# Altium schematic sheet Ethernet.SchDoc: Ethernet
size A4; Date: Not used; ApprovedBy: Not used; CheckedBy: Not used; Author: Not used; CompanyName: STMicroelectronics; DrawnBy: Not used; Engineer: Not used; Organization: Not used; Address1: Not used; Address2: Not used; Address3: Not used; Address4: Not used; DocumentNumber: 7; Revision: Not used; SheetNumber: 7; SheetTotal: 9; Time: Not used; ImagePath: Not used; Application_BuildNumber: Not used
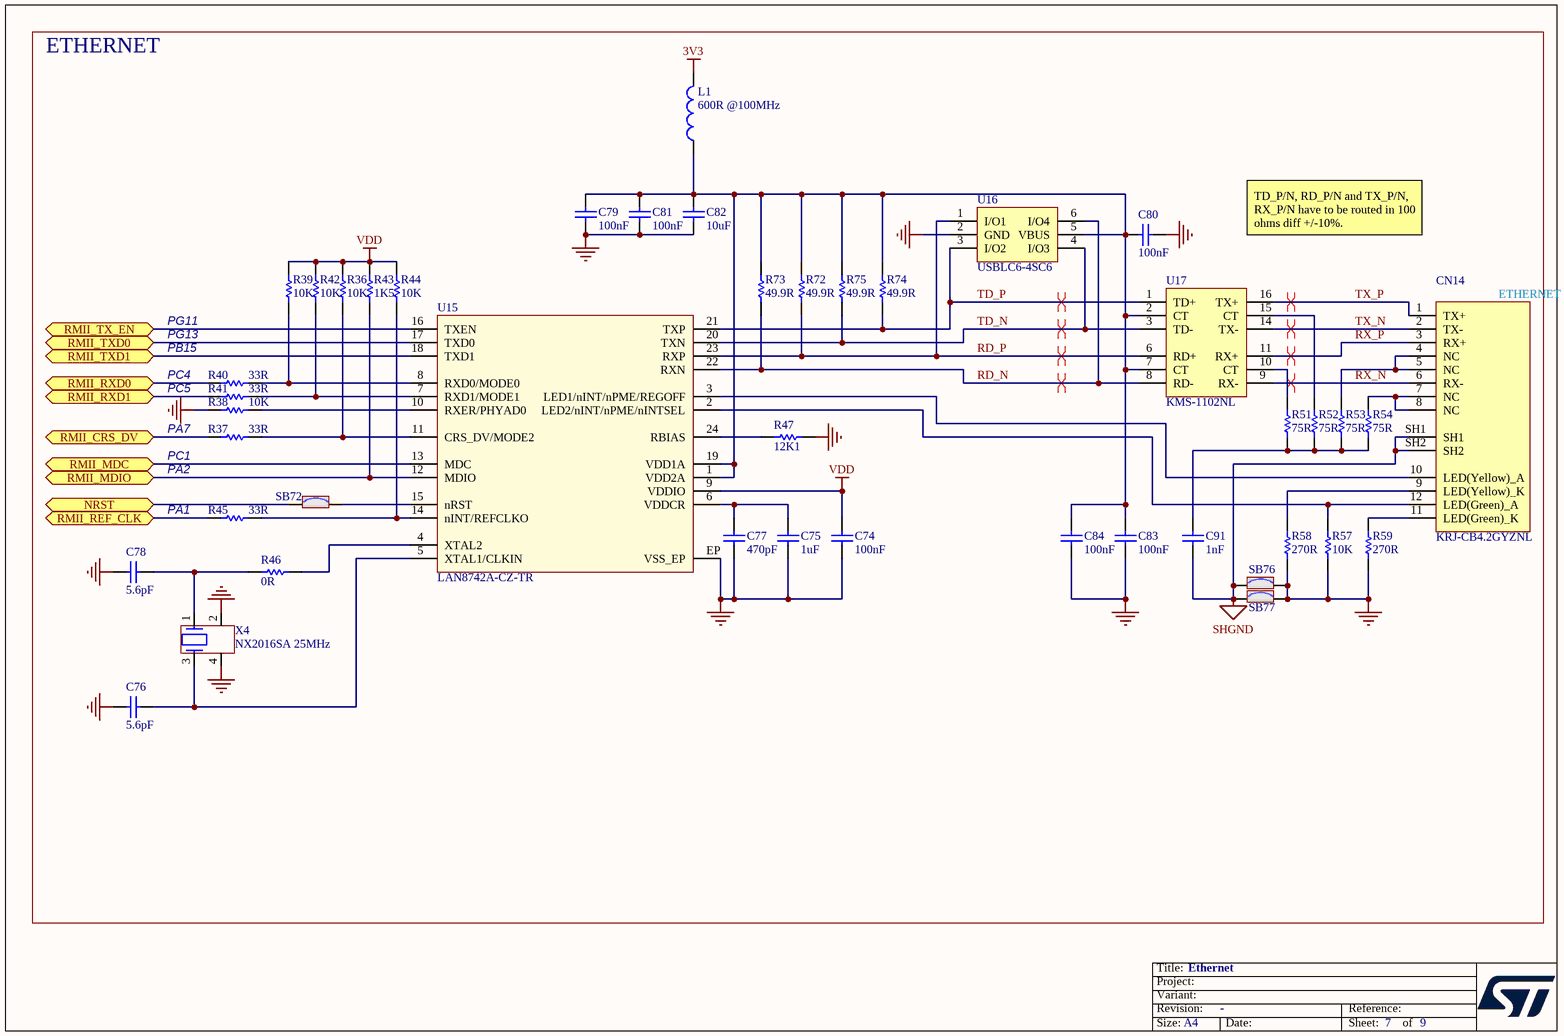
[diagram p0: Ethernet.SchDoc]

## Parts
C74  value 100nF  [C0603]  (hidden comment: Capacitor)
C75  value 1uF  [C0402]  (hidden comment: Capacitor)
C76  value 5.6pF  [C0402]  (hidden comment: Capacitor)
C77  value 470pF  [C0402]  (hidden comment: Capacitor)
C78  value 5.6pF  [C0402]  (hidden comment: Capacitor)
C79  value 100nF  [C0603]  (hidden comment: Capacitor)
C80  value 100nF  [C0603]  (hidden comment: Capacitor)
C81  value 100nF  [C0603]  (hidden comment: Capacitor)
C82  value 10uF  [C0603]  (hidden comment: Capacitor)
C83  value 100nF  [C0603]  (hidden comment: Capacitor)
C84  value 100nF  [C0603]  (hidden comment: Capacitor)
C91  value 1nF  [C1206_H1P6]  (hidden comment: Capacitor)
CN14  value KRJ-CB4.2GYZNL  [CON_RJ45_DGKYD_KRJ-CB4.2GYZNL]  (hidden comment: RJ45_KRJ-CB4.2GYZNL)
L1  value 600R @100MHz  [L0603]  (hidden comment: BEAD)
R36  value 10K  [R0402]  (hidden comment: Resistor)
R37  value 33R  [R0402]  (hidden comment: Resistor)
R38  value 10K  [R0402]  (hidden comment: Resistor)
R39  value 10K  [R0402]  (hidden comment: Resistor)
R40  value 33R  [R0402]  (hidden comment: Resistor)
R41  value 33R  [R0402]  (hidden comment: Resistor)
R42  value 10K  [R0402]  (hidden comment: Resistor)
R43  value 1K5  [R0402]  (hidden comment: Resistor)
R44  value 10K  [R0402]  (hidden comment: Resistor)
R45  value 33R  [R0402]  (hidden comment: Resistor)
R46  value 0R  [R0402]  (hidden comment: Resistor)
R47  value 12K1  [R0402]  (hidden comment: Resistor)
R51  value 75R  [R0402]  (hidden comment: Resistor)
R52  value 75R  [R0402]  (hidden comment: Resistor)
R53  value 75R  [R0402]  (hidden comment: Resistor)
R54  value 75R  [R0402]  (hidden comment: Resistor)
R57  value 10K  [R0402]  (hidden comment: Resistor)
R58  value 270R  [R0402]  (hidden comment: Resistor)
R59  value 270R  [R0402]  (hidden comment: Resistor)
R72  value 49.9R  [R0402]  (hidden comment: Resistor)
R73  value 49.9R  [R0402]  (hidden comment: Resistor)
R74  value 49.9R  [R0402]  (hidden comment: Resistor)
R75  value 49.9R  [R0402]  (hidden comment: Resistor)
SB72  SB_ON  [SOLDER-BRIDGE_R0603-0R]  (value not drawn)
SB76  SB_ON  [SOLDER-BRIDGE_R0603-0R]  (value not drawn)
SB77  SB_ON  [SOLDER-BRIDGE_R0603-0R]  (value not drawn)
U15  LAN8742A-CZ-TR  [ICC_VQFN24-EPAD_4X4_P050]
U16  USBLC6-4SC6  [ESD_SOT23-6L]
U17  KMS-1102NL  [TRS_DGKYD_KMS-1102NL]
X4  value NX2016SA 25MHz  [CRY_NX2016SA_4P]  (hidden comment: XTAL_4_PINS)

## Ports
NRST (bidir), RMII_CRS_DV (bidir), RMII_MDC (bidir), RMII_MDIO (bidir), RMII_REF_CLK (bidir), RMII_RXD0 (bidir), RMII_RXD1 (bidir), RMII_TX_EN (bidir), RMII_TXD0 (bidir), RMII_TXD1 (bidir)

## Nets
3V3: L1.2
GND: C74.1 C75.1 C76.1 C77.1 C78.1 C79.1 C80.1 C81.1 C82.1 C83.1 C84.1 R38.2 R47.2 R57.1 R58.1 R59.1 SB76.2 SB77.2 U15.EP(VSS_EP) U16.2(GND) X4.2 X4.4
SHGND: C91.1 CN14.SH1 CN14.SH2 SB76.1 SB77.1
VDD: C74.2 R36.2 R39.2 R42.2 R43.2 R44.2 U15.9(VDDIO)
NRST: SB72.1 ; port NRST
RD_N: R73.1 U15.22(RXN) U16.6(I/O4) U17.8(RD-)
RD_P: R72.1 U15.23(RXP) U16.1(I/O1) U17.6(RD+)
RMII_CRS_DV: R37.1 ; port RMII_CRS_DV
RMII_MDC: U15.13(MDC) ; port RMII_MDC
RMII_MDIO: R43.1 U15.12(MDIO) ; port RMII_MDIO
RMII_REF_CLK: R45.1 ; port RMII_REF_CLK
RMII_RXD0: R40.1 ; port RMII_RXD0
RMII_RXD1: R41.1 ; port RMII_RXD1
RMII_TX_EN: U15.16(TXEN) ; port RMII_TX_EN
RMII_TXD0: U15.17(TXD0) ; port RMII_TXD0
RMII_TXD1: U15.18(TXD1) ; port RMII_TXD1
RX_N: CN14.6(RX-) U17.9(RX-)
RX_P: CN14.3(RX+) U17.11(RX+)
TD_N: R75.1 U15.20(TXN) U16.4(I/O3) U17.3(TD-)
TD_P: R74.1 U15.21(TXP) U16.3(I/O2) U17.1(TD+)
TX_N: CN14.2(TX-) U17.14(TX-)
TX_P: CN14.1(TX+) U17.16(TX+)
NetC75_2: C75.2 C77.2 U15.6(VDDCR)
NetC76_2: C76.2 U15.5(XTAL1/CLKIN) X4.3
NetC78_2: C78.2 R46.1 X4.1
NetC79_2: C79.2 C80.2 C81.2 C82.2 C83.2 C84.2 L1.1 R72.2 R73.2 R74.2 R75.2 U15.1(VDD2A) U15.19(VDD1A) U16.5(VBUS) U17.2(CT) U17.7(CT)
NetC91_2: C91.2 R51.1 R52.1 R53.1 R54.1
NetCN14_4: CN14.4(NC) CN14.5(NC) R53.2
NetCN14_7: CN14.7(NC) CN14.8(NC) R54.2
NetCN14_9: CN14.9(LED(Yellow)_K) R58.2
NetCN14_10: CN14.10(LED(Yellow)_A) U15.3(LED1/nINT/nPME/REGOFF)
NetCN14_11: CN14.11(LED(Green)_K) R59.2
NetCN14_12: CN14.12(LED(Green)_A) R57.2 U15.2(LED2/nINT/nPME/nINTSEL)
NetR36_1: R36.1 R37.2 U15.11(CRS_DV/MODE2)
NetR38_1: R38.1 U15.10(RXER/PHYAD0)
NetR39_1: R39.1 R40.2 U15.8(RXD0/MODE0)
NetR41_2: R41.2 R42.1 U15.7(RXD1/MODE1)
NetR44_1: R44.1 R45.2 U15.14(nINT/REFCLKO)
NetR46_2: R46.2 U15.4(XTAL2)
NetR47_1: R47.1 U15.24(RBIAS)
NetR51_2: R51.2 U17.10(CT)
NetR52_2: R52.2 U17.15(CT)
NetSB72_2: SB72.2 U15.15(nRST)

## Layout directives
differential pair: RD_N, RD_P, RX_N, RX_P, TD_N, TD_P, TX_N, TX_P

## Notes on the sheet
- ETHERNET
- TD_P/N, RD_P/N and TX_P/N, RX_P/N have to be routed in 100 ohms diff +/-10%.
- (near CN14) ETHERNET
- PG11
- PG13
- PB15
- PC4
- PC5
- PA7
- PC1
- PA2
- (near R45) PA1
- Title:
- Project:
- Size:
- Revision:
- Variant:
- A4
- -
- Date:
- Reference:
- Sheet:
- of

## Library data of the parts
C74 C79-C81 C83 C84 = MCD-02119: Capacitor, MLCC, 100nF, 6V3, X5R, +/-10%, 0603, T=0.8mm; Part_Preference: Recommended; Manufacturer: KEMET; Manufacturer_Part_Number: C0603C104K9PACTU; Component_Country_Of_Origin: Mexico; ShowFields: YES; ID: 4219; Internal_Part_Number: MCD-02119; Status: Checked; Part_Type: Capacitor; Package: 0603; ComponentLink1URL: http://tunmcdsvn.tun.st.com/Component_Documentation_Library/Trunk/Capacitor/KEMET_X5R_Series/C0603C104K9PACTU; Order_Code_Digikey: N/A; Order_Code_Farnell: 2941311; Order_Code_RS: N/A
C75 = MCD-00095: Capacitor, MLCC, 1uF, 6V3, X5R, 10%, 0402, T=0,5mm; Manufacturer_Part_Number: GRM155R61E105KA12; Manufacturer: MURATA; Alternate_Manufacturer_Part_Number: GRM155R60J105KE19; Provided_By: SUBCO; ECCN_US: EAR99; ECCN_EU: NEC; Internal_Part_Number: MCD-00095; Status: Released; Part_Type: Capacitor; Package: C0402; ComponentLink1Description: Datasheet; ComponentLink1URL: http://tunmcdsvn.tun.st.com/Component_Datasheet_Library/Trunk/Capacitors/Murata_Capacitor_GR_series; Alternate_Manufacturer: MURATA
C76 C78 = MCD-01374: Capacitor, MLCC, 5.6pF, 50V, NPO, 5%, 0402, T=0,5mm; Manufacturer_Part_Number: CC0402BRNPO9BN5R6; Manufacturer: YAGEO; Provided_By: SUBCO; Internal_Part_Number: MCD-01374; Status: Released; Part_Type: Capacitor; Package: C0402; ComponentLink1Description: Datasheet; ComponentLink1URL: http://tunmcdsvn.tun.st.com/Component_Datasheet_Library/Trunk/Capacitors/Yageo_Capacitor_NP0_16V-to-50V; ECCN_US: N/A; ECCN_EU: N/A
C77 = MCD-00724: Capacitor, MLCC, 470pF, 50V, NPO, 5%, 0402, T=0,5mm; Manufacturer_Part_Number: CC0402JRNPO9BN471; Manufacturer: YAGEO; Provided_By: SUBCO; Internal_Part_Number: MCD-00724; Status: Released; Part_Type: Capacitor; Package: C0402; ComponentLink1Description: Datasheet; ComponentLink1URL: http://tunmcdsvn.tun.st.com/Component_Datasheet_Library/Trunk/Capacitors/Yageo_Capacitor_NP0_16V-to-50V; ECCN_US: N/A; ECCN_EU: N/A
C82 = MCD-01124: Capacitor, MLCC, 10µF, 10V, X5R, 10%, 0603, T=0.8mm; Manufacturer_Part_Number: GRM188R61A106KAAL; Manufacturer: MURATA; Provided_By: SUBCO; ECCN_US: EAR99; ECCN_EU: NEC; Internal_Part_Number: MCD-01124; Status: Released; Part_Type: Capacitor; Package: C0603; ComponentLink1Description: Datasheet; ComponentLink1URL: http://tunmcdsvn.tun.st.com/Component_Datasheet_Library/Trunk/Capacitors/Murata_Capacitor_GR_series
C91 = MCD-00722: Capacitor, MLCC, 1nF, 2KV, X7R, 10%, 1206, T=1,25mm; Manufacturer_Part_Number: CC1206KKX7RDBB102; Manufacturer: YAGEO; Provided_By: SUBCO; Internal_Part_Number: MCD-00722; Status: Released; Part_Type: Capacitor; Package: C1206; ComponentLink1Description: Datasheet; ComponentLink1URL: http://tunmcdsvn.tun.st.com/Component_Datasheet_Library/Trunk/Capacitors/Yageo_Multilayer_Capacitor_NPO_X7R_1KV_to_3KV_10pF_to_33nF/; ECCN_US: N/A; ECCN_EU: N/A
CN14 = MCD-00717: RJ45 jack, single port, with LEDS, Metal shielded dip low profile; Part_Type: Connector; Manufacturer: DONGGUAN KEYOUDA ELECTRONIC TECHNOLOGY; Provided_By: SUBCO; Internal_Part_Number: MCD-00717; Status: Released; Manufacturer_Part_Number: KRJ-CB4.2GYZNL; ComponentLink1Description: Datasheet; ComponentLink1URL: http://tunmcdsvn.tun.st.com/Component_Datasheet_Library/Trunk/Connectors/DGKYD_RJ45_KRJ-CB4.2GYZNL; ECCN_US: n/a; ECCN_EU: n/a
L1 = MCD-02437: Ferrite bead, 600R@100MHz, +/-25%, 500mA, 380mR, 0603, T=0.8mm; Part_Type: Inductor; Part_Preference: Recommended; Manufacturer: MURATA; Manufacturer_Part_Number: BLM18AG601SN1D; Order_Code_RS: 724-1299; Internal_Part_Number: MCD-02437; Status: Checked; Alternate_Manufacturer: N/A; Alternate_Manufacturer_Part_Number: N/A; Package: 0603; ComponentLink1URL: http://tunmcdsvn.tun.st.com/Component_Documentation_Library/Trunk/Inductor/MURATA_BLM_Series/MURATA_BLM18_Series/; Order_Code_Digikey: 490-1014-1-ND; Order_Code_Farnell: 1515679
R36 R38 R39 R42 R44 R57 = MCD-00053: Resistor,10K,0402,1%,1/16W; Manufacturer_Part_Number: RC0402FR-0710KL; Manufacturer: YAGEO; Provided_By: SUBCO; ECCN_US: EAR99; ECCN_EU: NEC; Internal_Part_Number: MCD-00053; Status: Released; Part_Type: Resistor; Package: R0402; ComponentLink1Description: Datasheet; ComponentLink1URL: http://tunmcdsvn.tun.st.com/Component_Datasheet_Library/Trunk/Resistors/Yageo_Resistor_RC0402-series
R37 R40 R41 R45 = MCD-00455: Resistor,33R,0402,1%,1/16W; Manufacturer_Part_Number: RC0402FR-0733RL; Manufacturer: YAGEO; Provided_By: SUBCO; ECCN_US: EAR99; ECCN_EU: NEC; Internal_Part_Number: MCD-00455; Status: Released; Part_Type: Resistor; Package: R0402; ComponentLink1Description: Datasheet; ComponentLink1URL: http://tunmcdsvn.tun.st.com/Component_Datasheet_Library/Trunk/Resistors/Yageo_Resistor_RC0402-series
R43 = MCD-00068: Resistor,1K5,0402,1%,1/16W; Manufacturer_Part_Number: RC0402FR-071K5L; Manufacturer: YAGEO; Provided_By: SUBCO; ECCN_US: EAR99; ECCN_EU: NEC; Internal_Part_Number: MCD-00068; Status: Released; Part_Type: Resistor; Package: R0402; ComponentLink1Description: Datasheet; ComponentLink1URL: http://tunmcdsvn.tun.st.com/Component_Datasheet_Library/Trunk/Resistors/Yageo_Resistor_RC0402-series
R46 = MCD-00052: Resistor,0R,0402,5%,1/16W; Manufacturer_Part_Number: RC0402JR-070RL; Manufacturer: YAGEO; Provided_By: SUBCO; ECCN_US: EAR99; ECCN_EU: NEC; Internal_Part_Number: MCD-00052; Status: Released; Part_Type: Resistor; Package: R0402; ComponentLink1Description: Datasheet; ComponentLink1URL: http://tunmcdsvn.tun.st.com/Component_Datasheet_Library/Trunk/Resistors/Yageo_Resistor_RC0402-series
R47 = MCD-00723: Resistor,12K1,0402,1%,1/16W; Manufacturer_Part_Number: RC0402FR-0712K1L; Manufacturer: YAGEO; Provided_By: SUBCO; ECCN_US: EAR99; ECCN_EU: NEC; Internal_Part_Number: MCD-00723; Status: Released; Part_Type: Resistor; Package: R0402; ComponentLink1Description: Datasheet; ComponentLink1URL: http://tunmcdsvn.tun.st.com/Component_Datasheet_Library/Trunk/Resistors/Yageo_Resistor_RC0402-series
R51-R54 = MCD-00515: Resistor,75R,0402,1%,1/16W; Manufacturer_Part_Number: RC0402FR-0775RL; Manufacturer: YAGEO; Provided_By: SUBCO; ECCN_US: EAR99; ECCN_EU: NEC; Internal_Part_Number: MCD-00515; Status: Released; Part_Type: Resistor; Package: R0402; ComponentLink1Description: Datasheet; ComponentLink1URL: http://tunmcdsvn.tun.st.com/Component_Datasheet_Library/Trunk/Resistors/Yageo_Resistor_RC0402-series
R58 R59 = MCD-00441: Resistor,270R,0402,1%,1/16W; Manufacturer_Part_Number: RC0402FR-07270RL; Manufacturer: YAGEO; Provided_By: SUBCO; ECCN_US: EAR99; ECCN_EU: NEC; Internal_Part_Number: MCD-00441; Status: Released; Part_Type: Resistor; Package: R0402; ComponentLink1Description: Datasheet; ComponentLink1URL: http://tunmcdsvn.tun.st.com/Component_Datasheet_Library/Trunk/Resistors/Yageo_Resistor_RC0402-series
R72-R75 = MCD-00565: Resistor,49R9,0402,1%,1/16W; Manufacturer_Part_Number: RC0402FR-0749R9L; Manufacturer: YAGEO; Provided_By: SUBCO; ECCN_US: EAR99; ECCN_EU: NEC; Internal_Part_Number: MCD-00565; Status: Released; Part_Type: Resistor; Package: R0402; ComponentLink1Description: Datasheet; ComponentLink1URL: http://tunmcdsvn.tun.st.com/Component_Datasheet_Library/Trunk/Resistors/Yageo_Resistor_RC0402-series
SB72 SB76 SB77 = MCD-00071: Solder Bridge ON; Part_Type: Mechanical; Manufacturer_Part_Number: RC0603JR-070RL; Manufacturer: YAGEO; Provided_By: SUBCO; Internal_Part_Number: MCD-00071; Status: Released; ComponentLink1Description: Datasheet; Package: SB0603; ComponentLink1URL: http://tunmcdsvn.tun.st.com/Component_Datasheet_Library/Trunk/Resistors/Yageo_Resistor_RC0603-series; ECCN_US: n/a; ECCN_EU: n/a
U15 = MCD-00719: 10/100M RMII Ethernet transceiver; Part_Type: IC; Manufacturer: MICROCHIP; Provided_By: SUBCO; Internal_Part_Number: MCD-00719; Value: LAN8742A-CZ-TR; Status: Released; Manufacturer_Part_Number: LAN8742A-CZ-TR; ComponentLink1Description: Datasheet; ComponentLink1URL: http://tunmcdsvn.tun.st.com/Component_Datasheet_Library/Trunk/IC/MICROCHIP_LAN8742A_RMII_PHY; ECCN_US: n/a; ECCN_EU: n/a
U16 = MCD-00250: Very low capacitance ESD protection , 4 lines; Part_Type: IC; Manufacturer: STMICROELECTRONICS; BMS_Part_Number: 9151001; Provided_By: SUBCO with ST control; ECCN_US: EAR99; ECCN_EU: NEC; Internal_Part_Number: MCD-00250; Value: USBLC6-4SC6; Status: Released; Manufacturer_Part_Number: USBLC6-4SC6; ComponentLink1Description: Datasheet; ComponentLink1URL: http://tunmcdsvn.tun.st.com/Component_Datasheet_Library/Trunk/Diodes/STM_ESD_USBLC6-4SC6
U17 = MCD-00718: Discrete Magnetic Transformer Module, 16 pins, SMT, 100 Base-TX; Part_Type: IC; Manufacturer: DONGGUAN KEYOUDA ELECTRONIC TECHNOLOGY; Provided_By: SUBCO; Internal_Part_Number: MCD-00718; Value: KMS-1102NL; Status: Released; Manufacturer_Part_Number: KMS-1102NL; ComponentLink1Description: Datasheet; ComponentLink1URL: http://tunmcdsvn.tun.st.com/Component_Datasheet_Library/Trunk/IC/DGKYD_KMS-1102NL; ECCN_US: n/a; ECCN_EU: n/a
X4 = MCD-01364: Crystal 25MHz, 6pF, +-20ppm, 80ohms max, SMD; Part_Type: Crystal_Osc; Manufacturer_Part_Number: NX2016SA 25MHz EXS00A-CS11321; Manufacturer: NDK; BMS_Part_Number: 9157044; Provided_By: SUBCO; ECCN_US: EAR99; ECCN_EU: NEC; Internal_Part_Number: MCD-01364; Status: Released; Package: NX2016SA; ComponentLink1Description: Datasheet; ComponentLink1URL: http://tunmcdsvn.tun.st.com/Component_Datasheet_Library/Trunk/Crystal_Osc/NDK_NX2016SA 25MHz EXS00A-CS11321 (EXS10B-28187); Order_Code_Digikey: 644-1367